# Altium schematic sheet PlacaDeDezvoltareGenerala.SchDoc: Placă de dezvoltare generală
size A3; Author: Elekes Norbert; DrawnBy: Elekes Norbert; Organization: .; Address1: .; Address2: .; Address3: .; Address4: .; DocumentNumber: 1; Revision: v1; SheetNumber: 1; SheetTotal: 1
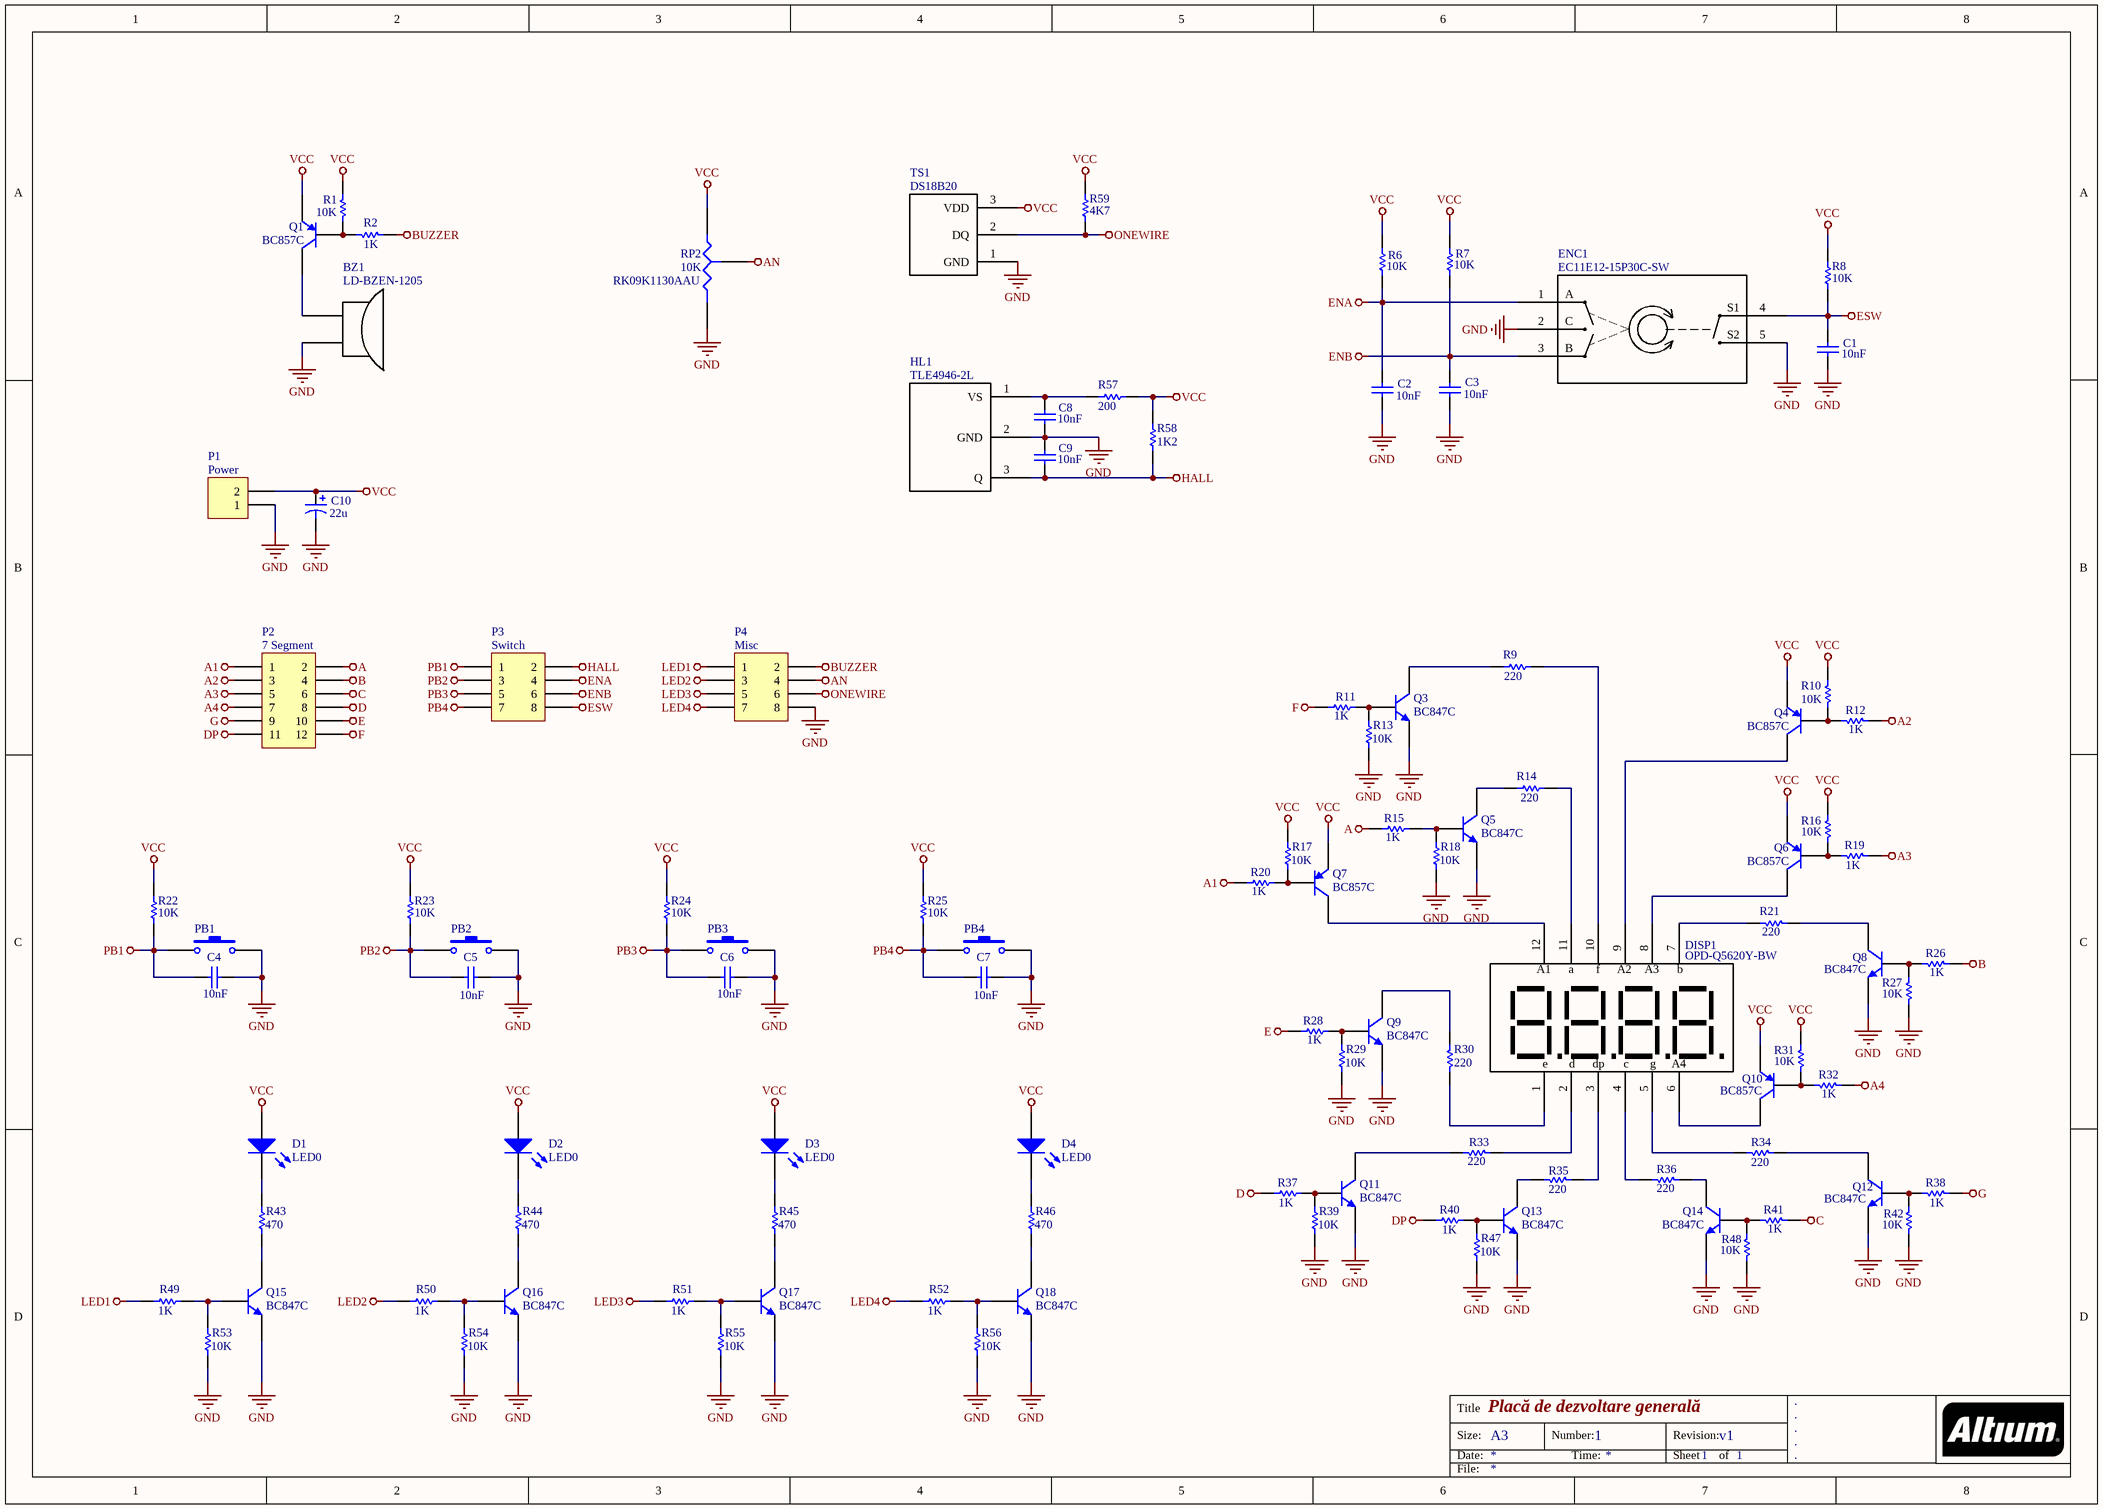
[diagram p0: PlacaDeDezvoltareGenerala.SchDoc]

## Parts
BZ1  LD-BZEN-1205  [BUZZER_12.0X8.5MM]
C1  value 10nF  [CAP 0805]  (hidden comment: Cap)
C2  value 10nF  [CAP 0805]  (hidden comment: Cap)
C3  value 10nF  [CAP 0805]  (hidden comment: Cap)
C4  value 10nF  [CAP 0805]  (hidden comment: Cap)
C5  value 10nF  [CAP 0805]  (hidden comment: Cap)
C6  value 10nF  [CAP 0805]  (hidden comment: Cap)
C7  value 10nF  [CAP 0805]  (hidden comment: Cap)
C8  value 10nF  [CAP 0805]  (hidden comment: Cap)
C9  value 10nF  [CAP 0805]  (hidden comment: Cap)
C10  value 22u  [CAP_ELEC_6.3x4.2]  (hidden comment: Cap Pol1)
D1  LED0  [LED0603GR]
D2  LED0  [LED0603GR]
D3  LED0  [LED0603GR]
D4  LED0  [LED0603GR]
DISP1  OPD-Q5620Y-BW  [7-SEG]
ENC1  EC11E12-15P30C-SW  [EC11E12]
HL1  TLE4946-2L  [TLE4946-2L]
P1  Power  [HEADER_1x2_2.54]
P2  7 Segment  [HEADER_2x6_2.54]
P3  Switch  [HEADER_2x4_2.54]
P4  Misc  [HEADER_2x4_2.54]
PB1  SW-PB  [PUSH BUTTON]  (value not drawn)
PB2  SW-PB  [PUSH BUTTON]  (value not drawn)
PB3  SW-PB  [PUSH BUTTON]  (value not drawn)
PB4  SW-PB  [PUSH BUTTON]  (value not drawn)
Q1  BC857C  [BC847C/BC857C]
Q3  BC847C  [BC847C/BC857C]
Q4  BC857C  [BC847C/BC857C]
Q5  BC847C  [BC847C/BC857C]
Q6  BC857C  [BC847C/BC857C]
Q7  BC857C  [BC847C/BC857C]
Q8  BC847C  [BC847C/BC857C]
Q9  BC847C  [BC847C/BC857C]
Q10  BC857C  [BC847C/BC857C]
Q11  BC847C  [BC847C/BC857C]
Q12  BC847C  [BC847C/BC857C]
Q13  BC847C  [BC847C/BC857C]
Q14  BC847C  [BC847C/BC857C]
Q15  BC847C  [BC847C/BC857C]
Q16  BC847C  [BC847C/BC857C]
Q17  BC847C  [BC847C/BC857C]
Q18  BC847C  [BC847C/BC857C]
R1  value 10K  [RES 0805]  (hidden comment: Res1)
R2  value 1K  [RES 0805]  (hidden comment: Res1)
R6  value 10K  [RES 0805]  (hidden comment: Res1)
R7  value 10K  [RES 0805]  (hidden comment: Res1)
R8  value 10K  [RES 0805]  (hidden comment: Res1)
R9  value 220  [RES 0805]  (hidden comment: Res1)
R10  value 10K  [RES 0805]  (hidden comment: Res1)
R11  value 1K  [RES 0805]  (hidden comment: Res1)
R12  value 1K  [RES 0805]  (hidden comment: Res1)
R13  value 10K  [RES 0805]  (hidden comment: Res1)
R14  value 220  [RES 0805]  (hidden comment: Res1)
R15  value 1K  [RES 0805]  (hidden comment: Res1)
R16  value 10K  [RES 0805]  (hidden comment: Res1)
R17  value 10K  [RES 0805]  (hidden comment: Res1)
R18  value 10K  [RES 0805]  (hidden comment: Res1)
R19  value 1K  [RES 0805]  (hidden comment: Res1)
R20  value 1K  [RES 0805]  (hidden comment: Res1)
R21  value 220  [RES 0805]  (hidden comment: Res1)
R22  value 10K  [RES 0805]  (hidden comment: Res1)
R23  value 10K  [RES 0805]  (hidden comment: Res1)
R24  value 10K  [RES 0805]  (hidden comment: Res1)
R25  value 10K  [RES 0805]  (hidden comment: Res1)
R26  value 1K  [RES 0805]  (hidden comment: Res1)
R27  value 10K  [RES 0805]  (hidden comment: Res1)
R28  value 1K  [RES 0805]  (hidden comment: Res1)
R29  value 10K  [RES 0805]  (hidden comment: Res1)
R30  value 220  [RES 0805]  (hidden comment: Res1)
R31  value 10K  [RES 0805]  (hidden comment: Res1)
R32  value 1K  [RES 0805]  (hidden comment: Res1)
R33  value 220  [RES 0805]  (hidden comment: Res1)
R34  value 220  [RES 0805]  (hidden comment: Res1)
R35  value 220  [RES 0805]  (hidden comment: Res1)
R36  value 220  [RES 0805]  (hidden comment: Res1)
R37  value 1K  [RES 0805]  (hidden comment: Res1)
R38  value 1K  [RES 0805]  (hidden comment: Res1)
R39  value 10K  [RES 0805]  (hidden comment: Res1)
R40  value 1K  [RES 0805]  (hidden comment: Res1)
R41  value 1K  [RES 0805]  (hidden comment: Res1)
R42  value 10K  [RES 0805]  (hidden comment: Res1)
R43  value 470  [RES 0805]  (hidden comment: Res1)
R44  value 470  [RES 0805]  (hidden comment: Res1)
R45  value 470  [RES 0805]  (hidden comment: Res1)
R46  value 470  [RES 0805]  (hidden comment: Res1)
R47  value 10K  [RES 0805]  (hidden comment: Res1)
R48  value 10K  [RES 0805]  (hidden comment: Res1)
R49  value 1K  [RES 0805]  (hidden comment: Res1)
R50  value 1K  [RES 0805]  (hidden comment: Res1)
R51  value 1K  [RES 0805]  (hidden comment: Res1)
R52  value 1K  [RES 0805]  (hidden comment: Res1)
R53  value 10K  [RES 0805]  (hidden comment: Res1)
R54  value 10K  [RES 0805]  (hidden comment: Res1)
R55  value 10K  [RES 0805]  (hidden comment: Res1)
R56  value 10K  [RES 0805]  (hidden comment: Res1)
R57  value 200  [RES 0805]  (hidden comment: Res1)
R58  value 1K2  [RES 0805]  (hidden comment: Res1)
R59  value 4K7  [RES 0805]  (hidden comment: Res1)
RP2  RK09K1130AAU  value 10K  [RK09K1130AAU]
TS1  DS18B20  [DS18B20]

## Nets
A: P2.2 R15.2
A1: P2.1 R20.2
A2: P2.3 R12.2
A3: P2.5 R19.2
A4: P2.7 R32.2
AN: P4.4 RP2.3(TAP)
B: P2.4 R26.2
BUZZER: P4.2 R2.2
C: P2.6 R41.2
D: P2.8 R37.2
DP: P2.11 R40.2
E: P2.10 R28.2
ENA: C2.2 ENC1.1 P3.4 R6.1
ENB: C3.2 ENC1.3 P3.6 R7.1
ESW: C1.2 ENC1.4 P3.8 R8.1
F: P2.12 R11.2
G: P2.9 R38.2
GND: BZ1.2 C1.1 C2.1 C3.1 C4.1 C5.1 C6.1 C7.1 C8.2 C9.1 C10.2 ENC1.2 ENC1.5 HL1.2(GND) P1.1 P4.8 PB1.2 PB2.2 PB3.2 PB4.2 Q3.1(E) Q5.1(E) Q8.1(E) Q9.1(E) Q11.1(E) Q12.1(E) Q13.1(E) Q14.1(E) Q15.1(E) Q16.1(E) Q17.1(E) Q18.1(E) R13.2 R18.2 R27.2 R29.2 R39.2 R42.2 R47.2 R48.2 R53.2 R54.2 R55.2 R56.2 RP2.2(B) TS1.1(GND)
HALL: C9.2 HL1.3(Q) P3.2 R58.1
LED1: P4.1 R49.1
LED2: P4.3 R50.1
LED3: P4.5 R51.1
LED4: P4.7 R52.1
ONEWIRE: P4.6 R59.1 TS1.2(DQ)
PB1: C4.2 P3.1 PB1.1 R22.1
PB2: C5.2 P3.3 PB2.1 R23.1
PB3: C6.2 P3.5 PB3.1 R24.1
PB4: C7.2 P3.7 PB4.1 R25.1
VCC: C10.1 D1.1(A) D2.1(A) D3.1(A) D4.1(A) P1.2 Q1.1(E) Q4.1(E) Q6.1(E) Q7.1(E) Q10.1(E) R1.1 R6.2 R7.2 R8.2 R10.1 R16.1 R17.1 R22.2 R23.2 R24.2 R25.2 R31.1 R57.2 R58.2 R59.2 RP2.1(A) TS1.3(VDD)
NetBZ1_1: BZ1.1 Q1.3(C)
NetC8_1: C8.1 HL1.1(VS) R57.1
NetD1_2: D1.2(K) R43.1
NetD2_2: D2.2(K) R44.1
NetD3_2: D3.2(K) R45.1
NetD4_2: D4.2(K) R46.1
NetDISP1_1: DISP1.1 R30.1
NetDISP1_2: DISP1.2 R33.2
NetDISP1_3: DISP1.3 R35.2
NetDISP1_4: DISP1.4 R36.1
NetDISP1_5: DISP1.5 R34.1
NetDISP1_6: DISP1.6 Q10.3(C)
NetDISP1_7: DISP1.7 R21.1
NetDISP1_8: DISP1.8 Q6.3(C)
NetDISP1_9: DISP1.9 Q4.3(C)
NetDISP1_10: DISP1.10 R9.1
NetDISP1_11: DISP1.11 R14.1
NetDISP1_12: DISP1.12 Q7.3(C)
NetQ1_2: Q1.2(B) R1.2 R2.1
NetQ3_2: Q3.2(B) R11.1 R13.1
NetQ3_3: Q3.3(C) R9.2
NetQ4_2: Q4.2(B) R10.2 R12.1
NetQ5_2: Q5.2(B) R15.1 R18.1
NetQ5_3: Q5.3(C) R14.2
NetQ6_2: Q6.2(B) R16.2 R19.1
NetQ7_2: Q7.2(B) R17.2 R20.1
NetQ8_2: Q8.2(B) R26.1 R27.1
NetQ8_3: Q8.3(C) R21.2
NetQ9_2: Q9.2(B) R28.1 R29.1
NetQ9_3: Q9.3(C) R30.2
NetQ10_2: Q10.2(B) R31.2 R32.1
NetQ11_2: Q11.2(B) R37.1 R39.1
NetQ11_3: Q11.3(C) R33.1
NetQ12_2: Q12.2(B) R38.1 R42.1
NetQ12_3: Q12.3(C) R34.2
NetQ13_2: Q13.2(B) R40.1 R47.1
NetQ13_3: Q13.3(C) R35.1
NetQ14_2: Q14.2(B) R41.1 R48.1
NetQ14_3: Q14.3(C) R36.2
NetQ15_2: Q15.2(B) R49.2 R53.1
NetQ15_3: Q15.3(C) R43.2
NetQ16_2: Q16.2(B) R50.2 R54.1
NetQ16_3: Q16.3(C) R44.2
NetQ17_2: Q17.2(B) R51.2 R55.1
NetQ17_3: Q17.3(C) R45.2
NetQ18_2: Q18.2(B) R52.2 R56.1
NetQ18_3: Q18.3(C) R46.2

## Notes on the sheet
- Title
- Size:
- Date:
- A3
- Number:
- Time:
- Revision:
- Sheet
- of
- File:
- (in symbol 7 Segment) A1; a; f; A2; A3; b; e; d; dp; c; g; A4
- (in symbol Encoder) A; S1; C; S2; B

## Library data of the parts
BZ1 = Buzzer
C1-C9 = Cap: Capacitor; Published: 8-Jun-2000; LatestRevisionDate: 17-Jul-2002; LatestRevisionNote: Re-released for DXP Platform.; PackageReference: RAD-0.3; Publisher: Altium Limited; PackageDescription: Radial Cap, Thru-Hole; 2 Leads; 0.3 in Pin Spacing
C10 = Cap Pol1: Polarized Capacitor (Radial); Published: 8-Jun-2000; LatestRevisionDate: 17-Jul-2002; LatestRevisionNote: Re-released for DXP Platform.; PackageReference: RB7.6-15; Publisher: Altium Limited; PackageDescription: Polarized Capacitor (Radial); 2 Leads
D1-D4 = LED0: Typical INFRARED GaAs LED; Published: 8-Jun-2000; LatestRevisionDate: 08-Jul-2005; LatestRevisionNote: Mech Layer 1 removed.; PackageReference: LED-0; Publisher: Altium Limited; PackageDescription: LED; 2 Leads
DISP1 = 7 Segment
ENC1 = Encoder
HL1 = Hall Latch TLE4946-2L
P1 = Header 2: Header, 2-Pin; LatestRevisionDate: 17-Jul-2002; LatestRevisionNote: Re-released for DXP Platform.; Publisher: Altium Limited
P2 = Header 6X2: Header, 6-Pin, Dual row; LatestRevisionDate: 17-Jul-2002; LatestRevisionNote: Re-released for DXP Platform.; Publisher: Altium Limited
P3 P4 = Header 4X2H: Header, 4-Pin, Dual row, Right Angle; LatestRevisionDate: 17-Jul-2002; LatestRevisionNote: Re-released for DXP Platform.; Publisher: Altium Limited
PB1-PB4 = SW-PB: Switch; Published: 24-Mar-1999; LatestRevisionDate: 17-Jul-2002; LatestRevisionNote: Re-released for DXP Platform.; PackageReference: SPST-2; Publisher: Altium Limited; PackageDescription: Switch; 2 Leads
Q1 Q4 Q6 Q7 Q10 = 2N3906: PNP General Purpose Amplifier; Published: 8-Jun-2000; LatestRevisionDate: 15-Jan-2003; LatestRevisionNote: PCB Footprint 'BCY-W3/D4.7' replaced; DatasheetVersion: 1997; PackageVersion: Sep-1998; PackageReference: TO-92A; Publisher: Altium Limited; PackageDescription: TO, Flat Index; 3 In-Line, Axial Leads; Body Dia. 4.5mm; Leads 0.51 x 0.48 mm (max); ComponentLink1Description: Manufacturer Link; ComponentLink1URL: http://www.fairchildsemi.com/; ComponentLink2Description: Datasheet; ComponentLink2URL: http://www.fairchildsemi.com/ds/2N%2F2N3906.pdf
Q3 Q5 Q8 Q9 Q11-Q18 = 2N3904: NPN General Purpose Amplifier; Published: 8-Jun-2000; LatestRevisionDate: 15-Jan-2003; LatestRevisionNote: PCB Footprint 'BCY-W3/D4.7' replaced; DatasheetVersion: 1997; PackageVersion: Sep-1998; PackageReference: TO-92A; Publisher: Altium Limited; PackageDescription: TO, Flat Index; 3 In-Line, Axial Leads; Body Dia. 4.5mm; Leads 0.51 x 0.48 mm (max); ComponentLink1Description: Manufacturer Link; ComponentLink1URL: http://www.fairchildsemi.com/; ComponentLink2Description: Datasheet; ComponentLink2URL: http://www.fairchildsemi.com/ds/2N%2F2N3904.pdf
R1 R2 R6-R59 = Res1: Resistor; Published: 8-Jun-2000; LatestRevisionDate: 17-Jul-2002; LatestRevisionNote: Re-released for DXP Platform.; PackageReference: AXIAL-0.3; Publisher: Altium Limited; PackageDescription: Axial Device, Thru-Hole; 2 Leads; 0.3 in Pin Spacing
RP2 = Res Tap: Tapped Resistor; Sim Note: Enter the Resistance value and the set point into parameter fields.; Set Position: 0.5; Published: 24-Mar-1999; LatestRevisionDate: 17-Jul-2002; LatestRevisionNote: Re-released for DXP Platform.; PackageReference: VR3; Publisher: Altium Limited; PackageDescription: Variable Resistor, Thru-Hole; 3 Leads